# EAGLE design Moisture senosor (EAGLE 6.5.0)
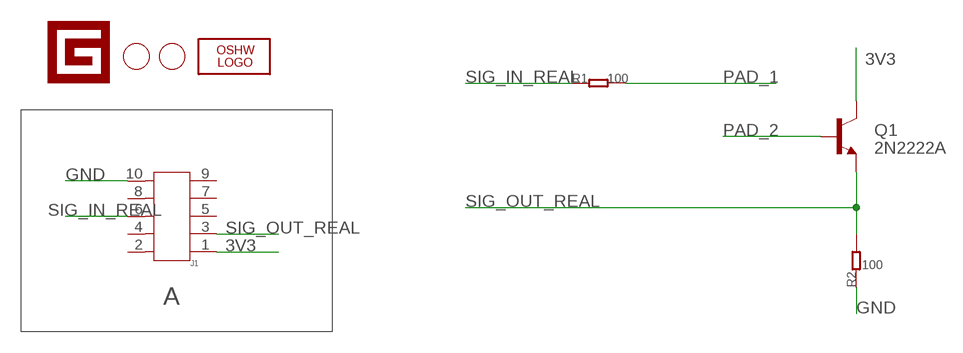
[diagram p0: schematic, sheet 1]

## Parts
J1  HEADER-SHF-105-01-L-D-SM  [SHF-105-01-L-D-SM]
LOGO1  LOGO-OSHW-FILLX0150-NT  [OSHW_FILLX150_NOTEXT]
Q1  2N2222A  TRANSISTOR_NPNTO92  [TO-92]
R1  100  R-0603  [0603]
R2  100  R-0603  [0603]
U$1  LOGO-GADGETEER-NORMAL  [GADGETEER-SILK]
U$2  PAD-HOLE'3.2/7.0'  [HOLE-D-3.2/7.0]
U$3  PAD-HOLE'3.2/7.0'  [HOLE-D-3.2/7.0]

## Nets
3V3: J1.1 Q1.3(C)
GND: J1.10 R2.1
PAD_1: R1.2
PAD_2: Q1.2(B)
SIG_IN_REAL: J1.6 R1.1
SIG_OUT_REAL: J1.3 Q1.1(E) R2.2
Unconnected: J1.2 J1.4 J1.5 J1.7 J1.8 J1.9

## Notes on the sheet
- A

## Library data of the parts
J1 = Connector:HEADER-SHF-105-01-L-D-SM
LOGO1 = Logo:LOGO-OSHW-FILL
Q1 = SparkFun:TRANSISTOR_NPN: Transistor NPN BJT configuration in SOT23 package. MMBT2222 is the common NPN we use. Double check BCE configuration again layout.
R1 R2 = Discrete:R*
U$1 = Logo:LOGO-GADGETEER
U$2 U$3 = Discreter:PAD-HOLE

## Board
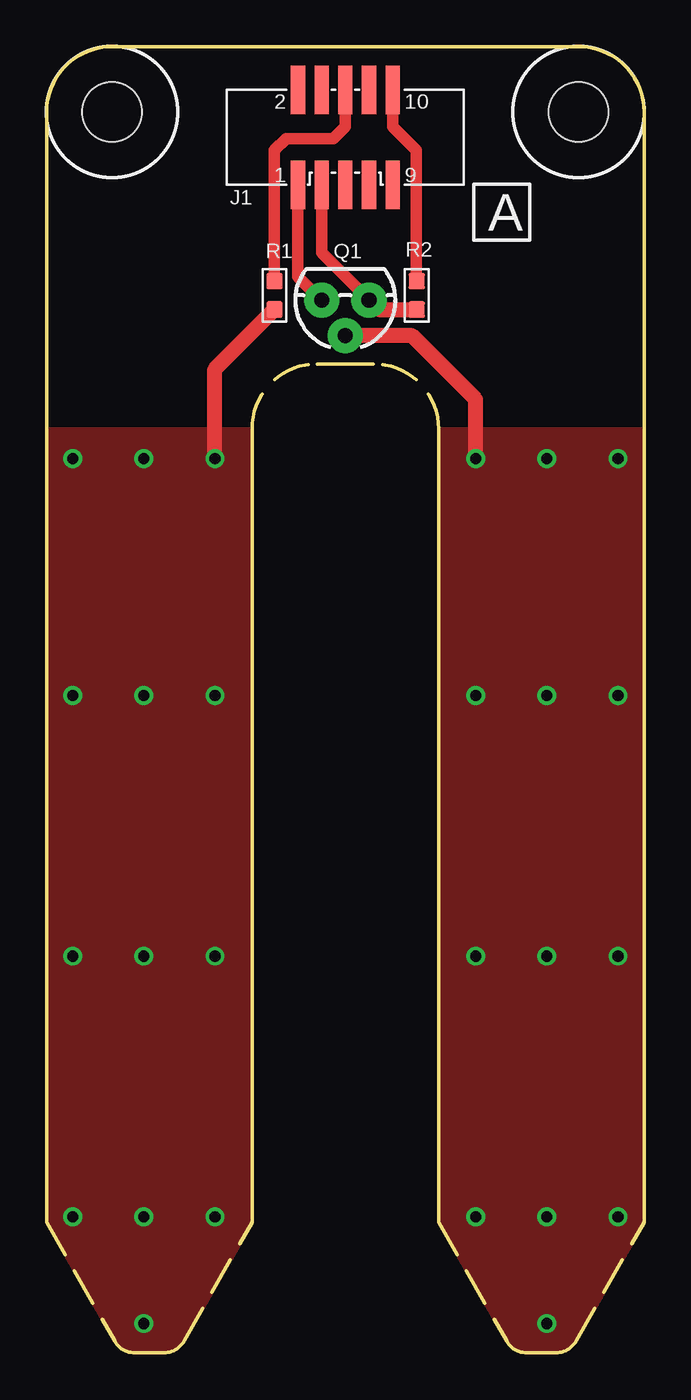
[diagram p1: board, top side]
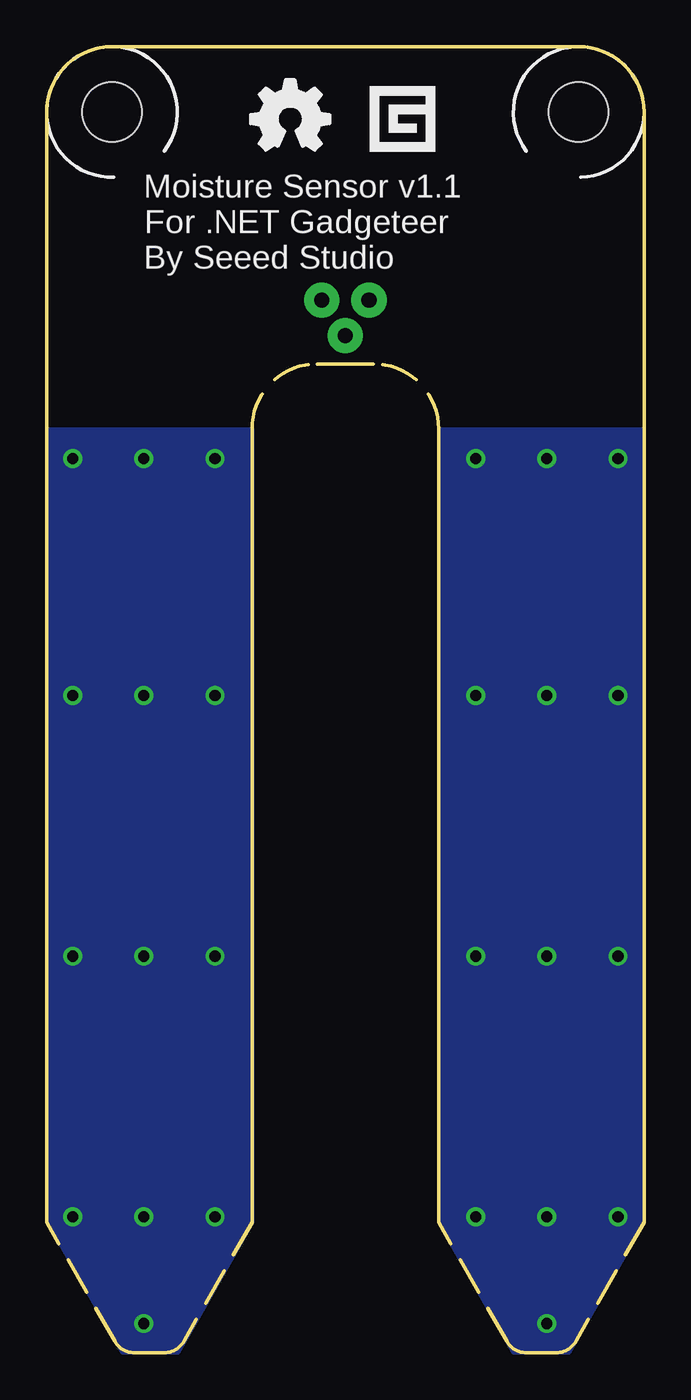
[diagram p2: board, bottom side, seen from below]

Size 32 x 70 mm. Coordinates in mm from the lower left corner, seen from the top.
Outline: 21,7 21,49 21,49.5 arc90 17.5,53 14.5,53 arc90 11,49.5 11,49 11,7 7.37,0.64 arc-60 6.26,0 4.74,0 arc-60 3.63,0.64 0,7 0,66.5 arc-90 3.5,70 28.5,70 arc-90 32,66.5 32,7 28.37,0.64 arc-60 27.26,0 25.74,0 arc-60 24.63,0.64 21,7
Copper layers (1*16): Top 0.035mm / dielectric 1.5mm / Bottom 0.035mm
Design rules "default": minimum track width 7mil, minimum drill 12mil, track to track 8mil, track to pad 8mil, pad to pad 8mil, via to via 8mil, smd to smd 8mil, copper to edge 0mil, drill to drill 8mil, minimum pad ring 10mil, minimum via ring 8mil, stop-mask expansion 4mil, vias tented up to drill 25mil, thermal gap 10mil

### Footprints (pad centres in the part's own frame; a part is rotated, then mirrored left to right if it is on the bottom)
SHF-105-01-L-D-SM = smd 0.762 x 2.6: 1 -2.54,-2.54; 2 -2.54,2.54; 3 -1.27,-2.54; 4 -1.27,2.54; 5 0,-2.54; 6 0,2.54; 7 1.27,-2.54; 8 1.27,2.54; 9 2.54,-2.546; 10 2.54,2.54
TO-92 = drill 0.813 pad 1.88: 1 -1.27,0; 2 0,1.905; 3 1.27,0
0603 = smd 0.889 x 0.889: 1 -0.762,0; 2 0.762,0
HOLE-D-3.2/7.0 = hole 3.2: 0,0

### Placement (x,y rotation side)
J1  16,65.14 0 top
LOGO1  21.08,64.44 0 bottom
Q1  16,56.42 180 top
R1  12.21,56.67 270 top
R2  19.82,56.67 270 top
U$1  12.52,66.56 0 bottom
U$2  28.5,66.5 0 top
U$3  3.5,66.5 0 top

### Tracks (layer width: path | path; a pad name or v marks a point on that pad's centre or on a via)
3V3
  Top 0.61: J1.1 13.46,57.69 Q1.3
GND
  Top 0.61: J1.10 18.54,65.71 19.81,64.44 19.81,57.45 R2.1
PAD_1  (via drill 0.6)
  Top 0.813: v9.02,47.93 9.02,52.72 R1.2
  other vias: 1.39,7.29 9.02,35.23 9.02,7.29 5.21,35.23 5.21,1.58 5.21,7.29 1.39,35.23 5.21,21.26 1.39,21.26 9.02,21.26 1.39,47.93 5.21,47.93
  pour Top (no thermals): 11,49.5 0,49.5 0,7 3.63,0.64 arc60 4.74,0 6.26,0 arc60 7.37,0.64 11,7
  pour Bottom (no thermals): 11,49.5 0,49.5 0,7.07 arc30 0.03,6.94 4,0 6.5,0 7,0 11,7
PAD_2  (via drill 0.6)
  Top 0.813: v22.98,47.93 22.98,51.11 19.58,54.51 Q1.2
  other vias: 30.61,47.93 22.98,35.23 26.8,35.23 30.61,35.23 22.98,21.26 22.98,7.29 26.8,21.26 26.8,7.29 26.8,1.58 30.61,21.26 30.61,7.29 26.8,47.93
  pour Top (no thermals): 32,49.5 21,49.5 21,7 24.63,0.64 arc60 25.74,0 27.26,0 arc60 28.37,0.64 31.9,6.83 arc15 32,7.07
  pour Bottom (no thermals): 31.95,49.5 20.95,49.5 20.95,7 24.95,0 27.45,0 27.95,0 31.95,7
SIG_IN_REAL
  Top 0.61: R1.1 12.21,64.45 12.82,65.08 15.37,65.08 16,65.71 J1.6 16,68.25
SIG_OUT_REAL
  Top 0.61: J1.3 14.73,58.96 Q1.1
  Top 0.813: R2.2 17.78,55.91 Q1.1

### Text on the board
tPlace: A
bPlace: Moisture Sensor v1.1 | For .NET Gadgeteer | By Seeed Studio